# Altium schematic sheet Connector.SchDoc
size B; DocumentNumber: 3; SheetNumber: 3; SheetTotal: 3; ENG_APP_DATE: --/--/--; DSN_APP_DATE: --/--/--; CHK_APP_DATE: --/--/--
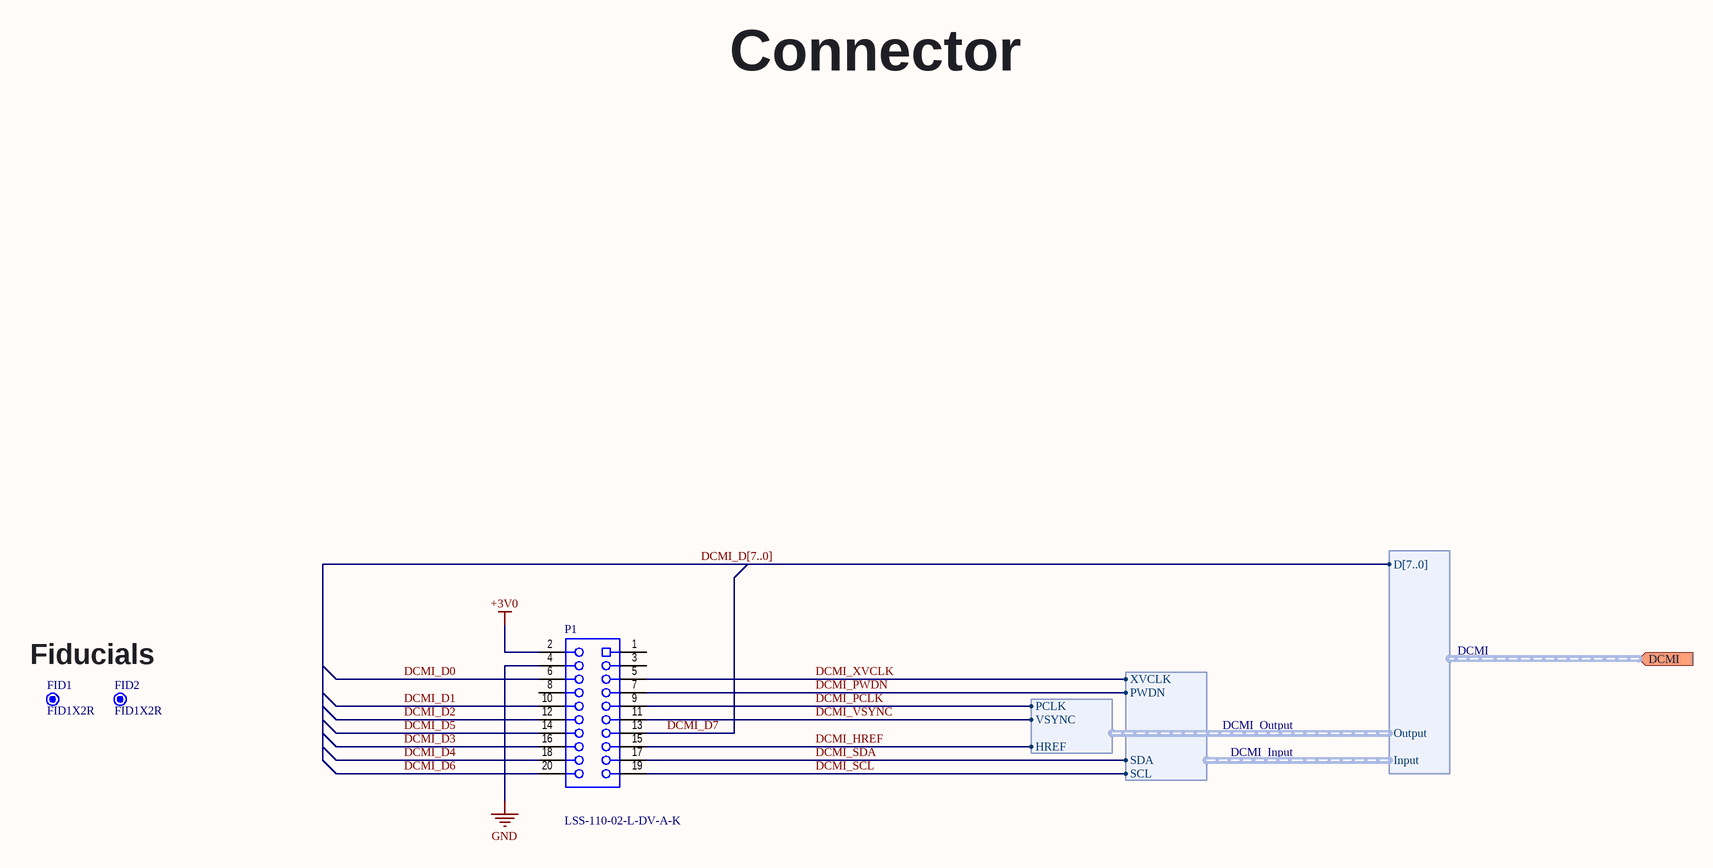
[diagram p0: Connector.SchDoc]

## Parts
FID1  FID1X2R  [FID1X2R]  (no BOM)
FID2  FID1X2R  [FID1X2R]  (no BOM)
P1  LSS-110-02-L-DV-A-K  [SMTC - LSS-110-02-L-DV-A_V]

## Ports
DCMI (in, harness DCMI)

## Harnesses
DCMI: Input, Output, D[7..0]
DCMI_Input: PWDN, SCL, SDA, XVCLK
DCMI_Output: HREF, PCLK, VSYNC

## Nets
+3V0: P1.2
GND: P1.4
DCMI_D0: P1.6
DCMI_D1: P1.10
DCMI_D2: P1.12
DCMI_D3: P1.16
DCMI_D4: P1.18
DCMI_D5: P1.14
DCMI_D6: P1.20
DCMI_D7: P1.13
DCMI_HREF: P1.15 ; harness DCMI_Output.HREF
DCMI_PCLK: P1.9 ; harness DCMI_Output.PCLK
DCMI_PWDN: P1.7 ; harness DCMI_Input.PWDN
DCMI_SCL: P1.19 ; harness DCMI_Input.SCL
DCMI_SDA: P1.17 ; harness DCMI_Input.SDA
DCMI_VSYNC: P1.11 ; harness DCMI_Output.VSYNC
DCMI_XVCLK: P1.5 ; harness DCMI_Input.XVCLK

Not connected (* = marked no-connect by the designer): P1 1 3 8

## Buses and harness runs
bus DCMI_D[7..0]

## Notes on the sheet
- Connector
- Fiducials
- Drawing Title:
- Page Title:
- Size:
- B
- Document Number
- Variant:
- Rev:
- Date:
- Sheet:
- of

## Library data of the parts
FID1 FID2 = CMP-MECH-00000-3: Fiducial - Round 1x2mm; Pins: 0
P1 = CMP-CON-0021-3: 20 Position Connector Self Mating, Non-Gendered Surface Mount Gold; Number of Contacts: 20; Pitch: 0.635mm; Termination: Solder; Radiation Hardening: No; Number of Rows: 2; Packaging: Bulk; Contact Plating: Gold